# Altium schematic sheet 30V Output Design.schdoc
size 344 x 165 mm; SheetNumber: 1; SheetTotal: 1
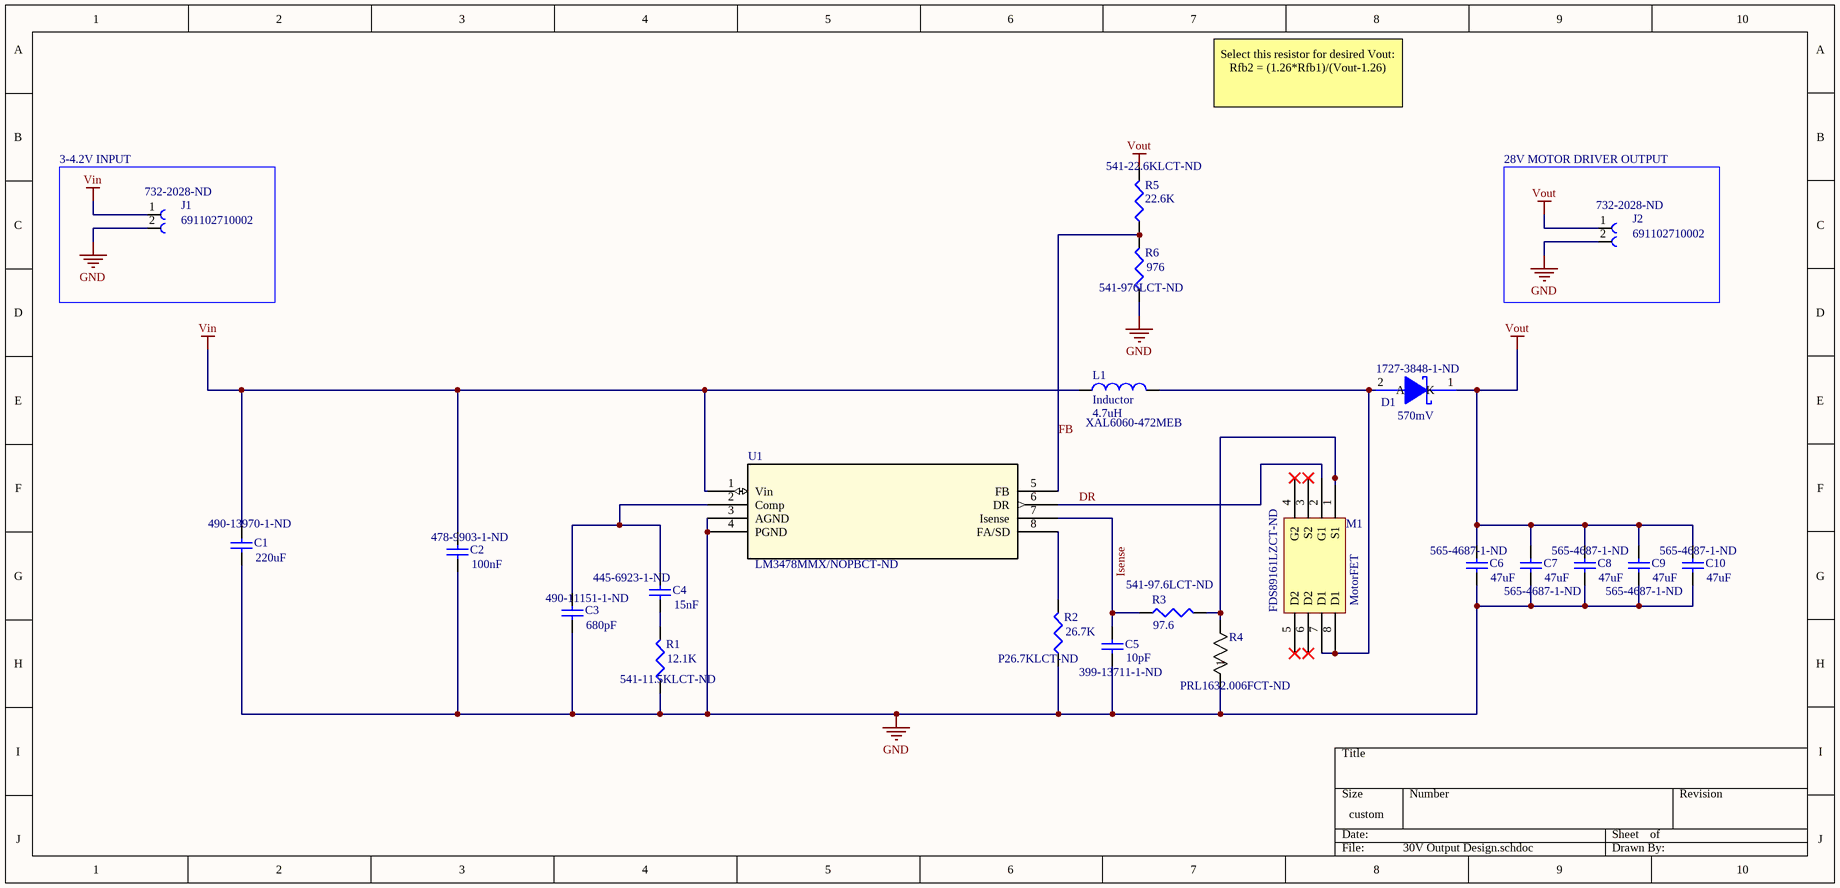
[diagram p0: 30V Output Design.schdoc]

## Parts
C1  value 220uF  Supplier Part Number 1: 490-13970-1-ND  [C1206]  (hidden comment: Input cap)
C2  value 100nF  Supplier Part Number 1: 478-9903-1-ND  [1608[0603]]  (hidden comment: bypass cap)
C3  value 680pF  Supplier Part Number 1: 490-11151-1-ND  [0402]  (hidden comment: CL05C681JB5NNNC)
C4  value 15nF  Supplier Part Number 1: 445-6923-1-ND  [1608[0603]]  (hidden comment: Cap Semi)
C5  value 10pF  Supplier Part Number 1: 399-13711-1-ND  [1608[0603]]  (hidden comment: CL21C100JBANNNC)
C6  value 47uF  Supplier Part Number 1: 565-4687-1-ND  [CAP-2 J-lead]  (hidden comment: Cap Semi)
C7  value 47uF  Supplier Part Number 1: 565-4687-1-ND  [CAP-2 J-lead]
C8  value 47uF  Supplier Part Number 1: 565-4687-1-ND  [CAP-2 J-lead]
C9  value 47uF  Supplier Part Number 1: 565-4687-1-ND  [CAP-2 J-lead]
C10  value 47uF  Supplier Part Number 1: 565-4687-1-ND  [CAP-2 J-lead]
D1  value 570mV  Supplier Part Number 1: 1727-3848-1-ND  [SOD323F]  (hidden comment: PMEG6010CEH,115)
J1  691102710002  Supplier Part Number 1: 732-2028-ND  [CON2_SCREW_5.00MM_691102710002]
J2  691102710002  Supplier Part Number 1: 732-2028-ND  [CON2_SCREW_5.00MM_691102710002]
L1  Inductor  value 4.7uH  Supplier Part Number 1: XAL6060-472MEB  [XAL6060-472]
M1  MotorFET  Supplier Part Number 1: FDS89161LZCT-ND  [MotorFETSOIC127P590X175-8N]
R1  value 12.1K  Supplier Part Number 1: 541-11.5KLCT-ND  [RES_CRCW_0402]
R2  value 26.7K  Supplier Part Number 1: P26.7KLCT-ND  [RES_CRCW_0402]  (hidden comment: Rfadj)
R3  value 97.6  Supplier Part Number 1: 541-97.6LCT-ND  [RES_CRCW_0402]  (hidden comment: Rfilt)
R4  Supplier Part Number 1: PRL1632.006FCT-ND  [RES_3216]  (hidden comment: PRL1632-R006-F-T1)
R5  value 22.6K  Supplier Part Number 1: 541-22.6KLCT-ND  [RES_CRCW_0402]  (hidden comment: Rfb1)
R6  value 976  Supplier Part Number 1: 541-976LCT-ND  [RES_CRCW_0402]  (hidden comment: Rfb2)
U1  Supplier Part Number 1: LM3478MMX/NOPBCT-ND  [MUA08A]  (hidden comment: Part Number: LM3478MMX/NOPB)

## Blocks framed on the sheet
3-4.2V INPUT: J1
28V MOTOR DRIVER OUTPUT: J2

## Nets
GND: C1.1 C2.1 C3.1 C5.1 C6.1 C7.1 C8.1 C9.1 C10.1 J1.2 J2.2 R1.1 R2.1 R4.1 R6.1 U1.3(AGND) U1.4(PGND)
Vin: C1.2 C2.2 J1.1 L1.1 U1.1(Vin)
Vout: C6.2 C7.2 C8.2 C9.2 C10.2 D1.1(K) J2.1 R5.2
DR: M1.2(G1) U1.6(DR)
FB: R5.1 R6.2 U1.5(FB)
Isense: C5.2 R3.1 U1.7(Isense)
NetC3_2: C3.2 C4.2 U1.2(Comp)
NetC4_1: C4.1 R1.2
NetD1_2: D1.2(A) L1.2 M1.7(D1) M1.8(D1)
NetM1_1: M1.1(S1) R3.2 R4.2
NetR2_2: R2.2 U1.8(FA/SD)

Not connected (* = marked no-connect by the designer): M1 3(S2)* 4(G2)* 5(D2)* 6(D2)*

## Notes on the sheet
- Select this resistor for desired Vout:
  Rfb2 = (1.26*Rfb1)/(Vout-1.26)

## Library data of the parts
C1 = Cap Semi: CAP CER 220UF 6.3V X5R 1210; Manufacturer: Murata; Manufacturer Part Number: GRM31CR60J227ME11L; Tolerance: 20%; Published: 8-Jun-2000; LatestRevisionDate: 29-May-2009; LatestRevisionNote: IPC-7351 Footprint Added.; PackageReference: C1206; Publisher: Altium Limited; PackageDescription: Chip Capacitor; Supplier 1: Digi-Key; Stock 1: 189904; Pricing 1: 1=1.52, 10=1.199, 100=0.8992, 500=0.67938, 1000=0.59945 (USD); Mount: Surface Mount; Case/Package: 1206; Case Code (Metric): 3216; Case Code (Imperial): 1206; Min Operating Temperature: -55°C; Max Operating Temperature: 85°C; Packaging: Cut Tape; Voltage Rating: 6.3V; Dielectric: X5R; Voltage Rating (DC): 6.3V; Capacitance: 220uF; Length: 0.126inch; Width: 0.063inch; Thickness: 0.075inch; REACH SVHC: No SVHC
C2 = Cap Semi: Capacitor (Semiconductor SIM Model) https://www.digikey.ca/product-detail/en/avx-corporation/06035C104K4T4A/478-9903-1-ND/6002664; Published: 8-Jun-2000; LatestRevisionDate: 29-May-2009; LatestRevisionNote: IPC-7351 Footprint Added.; PackageReference: C1206; Publisher: Altium Limited; PackageDescription: Chip Capacitor; Supplier 1: Digi-Key
C3 = Cap Semi: CL05C681JB5NNNC - comparator cap 2; Published: 8-Jun-2000; LatestRevisionDate: 29-May-2009; LatestRevisionNote: IPC-7351 Footprint Added.; PackageReference: C1206; Publisher: Altium Limited; PackageDescription: Chip Capacitor; Supplier 1: Digi-Key
C4 = Cap Semi: CGA4F2C0G1H153J085AA comparator cap; Published: 8-Jun-2000; LatestRevisionDate: 29-May-2009; LatestRevisionNote: IPC-7351 Footprint Added.; PackageReference: C1206; Publisher: Altium Limited; PackageDescription: Chip Capacitor; Supplier 1: Digi-Key
C5 = Cap Semi: Capacitor (Semiconductor SIM Model) filter cap; Published: 8-Jun-2000; LatestRevisionDate: 29-May-2009; LatestRevisionNote: IPC-7351 Footprint Added.; PackageReference: C1206; Publisher: Altium Limited; PackageDescription: Chip Capacitor; Supplier 1: Digi-Key
C6-C10 = Cap Semi: EEHZA1H101P - from TI output cap; Manufacturer: United Chemi-Con; Manufacturer Part Number: KTJ500B476M76BFT00; Voltage Rating: 50V; Tolerance: 20%; Lead/Base Style: J-Lead; Published: 8-Jun-2000; LatestRevisionDate: 29-May-2009; LatestRevisionNote: IPC-7351 Footprint Added.; PackageReference: C1206; Publisher: Altium Limited; PackageDescription: Chip Capacitor; Supplier 1: Digi-Key; Stock 1: 2228; Pricing 1: 1=6.35, 10=5.642, 100=4.5135 (USD); Mount: Surface Mount; Case/Package: SMD/SMT; Min Operating Temperature: -55°C; Max Operating Temperature: 125°C; Packaging: Tape and Reel; Capacitance: 47uF; Length: 0.26inch; Width: 0.307inch; Thickness: 0.335inch
D1 = PMEG6010CEH,115: Manufacturer Name: Nexperia; PackageReference: PMEG6010CEH,115; Manufacturer Part Number: PMEG6010CEH,115; Supplier 1: Digi-Key; Manufacturer: Nexperia; Stock 1: 43160; Pricing 1: 1=0.46, 10=0.344, 100=0.2141, 500=0.1465, 1000=0.11269 (USD)
J1 J2 = 691102710002: Screw terminal 0.33 mmÂ² Number of pins 2 Wuerth Elektronik Blue 1 pc_s_; MF: Wurth Electronics; Availability: Unavailable; MP: 691102710002; SnapEDA_Link: https://www.snapeda.com/parts/691102710002/Wurth%20Electronics%20Inc./view-part/?ref=snap; Price: None; Package: None; Value: *; Supplier 1: Digi-Key
L1 = Inductor: Inductor CoilCraft; Code_IEC: 1005; Core Material: Composite; Shielding: Shielded; Tolerance: 20%; Self Resonant Frequency: 21MHz; Max DC Current: 11A; DC Resistance (DCR): 14.4mR; Test Frequency: 100kHz; Published: 8-Jun-2000; LatestRevisionDate: 29-May-2009; LatestRevisionNote: IPC-7351 Footprint Added.; PackageReference: 0402-A; Publisher: Altium Limited; PackageDescription: Chip Inductor; Code_JEITA: 0402; Supplier 1: Coilcraft Direct; Manufacturer: Coilcraft; Manufacturer Part Number: XAL6060-472MEB; Stock 1: 0; Pricing 1: 1=2.58, 100=2.25, 250=1.76, 500=1.05, 1000=0.82, 2500=0.71 (USD); Min Operating Temperature: -40°C; Max Operating Temperature: 125°C; Packaging: Tape and Reel; Package Quantity: 21; Inductance: 4.7uH; Termination: SMD/SMT; Length: 6.76mm; Height: 6.1mm; Width: 6.56mm; Lead Free: Contains Lead
M1 = MotorFET: Manufacturer: ON Semiconductor / Fairchild; Manufacturer Part Number: FDS89161LZ; Rds On Max: 105mR; Input Capacitance: 302pF; Rise Time: 10ns; Drain to Source Voltage (Vdss): 100V; Continuous Drain Current (ID): 2.7A; Max Power Dissipation: 1.6W; Power Dissipation: 31W; Turn-Off Delay Time: 9.5ns; Turn-On Delay Time: 3.8ns; Element Configuration: Dual; Gate to Source Voltage (Vgs): 20V; FET Type: 2 N-Channel; Supplier 1: Digi-Key; Stock 1: 13231; Pricing 1: 1=1.51, 10=1.335, 100=1.0548, 500=0.81802, 1000=0.64581 (USD); Mount: Surface Mount; Case/Package: SOIC; Number of Pins: 8; Weight: 0.187g; Min Operating Temperature: -55°C; Max Operating Temperature: 150°C; Package Quantity: 2500; Packaging: Tape and Reel; Drain to Source Breakdown Voltage: 100V; Fall Time: 10ns; Drain to Source Resistance: 105mR; Length: 4.9mm; Height: 1.575mm; Width: 3.9mm; Radiation Hardening: No; ComponentLink1URL: http://www.mouser.com/ds/2/149/FDS89161LZ-108942.pdf?src-supplier=Mouser; ComponentLink1Description: http://www.mouser.com/ds/2/149/FDS89161LZ-108942.pdf?src-supplier=Mouser; ComponentLink2URL: http://www.fairchildsemi.com/ds/FD/FDS89161LZ.pdf?src-supplier=Digi-Key; ComponentLink2Description: http://www.fairchildsemi.com/ds/FD/FDS89161LZ.pdf?src-supplier=Digi-Key; ComponentLink3URL: https://www.fairchildsemi.com/datasheets/FD/FDS89161LZ.pdf?src-supplier=Digi-Key; ComponentLink3Description: https://www.fairchildsemi.com/datasheets/FD/FDS89161LZ.pdf?src-supplier=Digi-Key; ComponentLink4URL: https://www.fairchildsemi.com/datasheets/FD/FDS89161LZ.pdf?src-supplier=Avnet; ComponentLink4Description: https://www.fairchildsemi.com/datasheets/FD/FDS89161LZ.pdf?src-supplier=Avnet; ComponentLink5URL: https://www.fairchildsemi.com/datasheets/FD/FDS89161LZ.pdf?src-supplier=Avnet+Europe; ComponentLink5Description: https://www.fairchildsemi.com/datasheets/FD/FDS89161LZ.pdf?src-supplier=Avnet+Europe
R1 = Res3: comparator resistor; Manufacturer: Vishay; Manufacturer Part Number: CRCW040211K5FKED; Voltage Rating: 50V; Resistance: 11.5kR; Power Rating: 63mW; Tolerance: 1%; Temperature Coefficient: 100ppm/°C; Published: 8-Jun-2000; LatestRevisionDate: 29-May-2009; LatestRevisionNote: IPC-7351 Footprint Added.; PackageReference: J1-0603; Publisher: Altium Limited; PackageDescription: Chip Resistor; Supplier 1: Digi-Key; Stock 1: 7488; Pricing 1: 1=0.1, 10=0.042, 100=0.017, 1000=0.00765, 2500=0.00664, 5000=0.00549 (USD); Case/Package: 0402; Number of Pins: 2; Weight: 2.3E-05oz; Case Code (Metric): 1005; Case Code (Imperial): 0402; Contact Plating: Tin; Min Operating Temperature: -55°C; Max Operating Temperature: 155°C; Packaging: Tape and Reel; Package Quantity: 10; Composition: Thick Film; Number of Terminations: 2; Termination: SMD/SMT; Military Standard: Not; Max Power Dissipation: 63mW; Voltage Rating (DC): 50V; Features: Automotive AEC-Q200; Length: 1mm; Height: 0.35mm; Width: 0.02inch; Depth: 0.5mm; Radiation Hardening: No; REACH SVHC: Unknown; Lead Free: Lead Free; ComponentLink1URL: http://www.vishay.com/docs/20035/dcrcwe3.pdf?src-supplier=Digi-Key; ComponentLink1Description: http://www.vishay.com/docs/20035/dcrcwe3.pdf?src-supplier=Digi-Key; ComponentLink2URL: http://www.mouser.com/ds/2/427/dcrcwe3-109170.pdf?src-supplier=Mouser; ComponentLink2Description: http://www.mouser.com/ds/2/427/dcrcwe3-109170.pdf?src-supplier=Mouser; ComponentLink3URL: http://www.farnell.com/datasheets/1697337.pdf?src-supplier=Farnell; ComponentLink3Description: http://www.farnell.com/datasheets/1697337.pdf?src-supplier=Farnell; ComponentLink4URL: http://uk.rs-online.com/webdocs/0d98/0900766b80d98824.pdf?src-supplier=RSComponents; ComponentLink4Description: http://uk.rs-online.com/webdocs/0d98/0900766b80d98824.pdf?src-supplier=RSComponents; ComponentLink5URL: http://www.farnell.com/datasheets/1697337.pdf?src-supplier=Element14; ComponentLink5Description: http://www.farnell.com/datasheets/1697337.pdf?src-supplier=Element14; ComponentLink6URL: https://www.alliedelec.com/m/d/0c934d6939ccefa68dbe0b96d821c8cf.pdf?src-supplier=Allied+Electronics; ComponentLink6Description: https://www.alliedelec.com/m/d/0c934d6939ccefa68dbe0b96d821c8cf.pdf?src-supplier=Allied+Electronics; ComponentLink7URL: http://www.farnell.com/datasheets/1824995.pdf?src-supplier=Element14; ComponentLink7Description: http://www.farnell.com/datasheets/1824995.pdf?src-supplier=Element14; ComponentLink8URL: http://www.vishay.com/docs/20035/dcrcwe3.pdf?src-supplier=Avnet; ComponentLink8Description: http://www.vishay.com/docs/20035/dcrcwe3.pdf?src-supplier=Avnet; ComponentLink9URL: http://www.farnell.com/datasheets/2111203.pdf?src-supplier=Element14; ComponentLink9Description: http://www.farnell.com/datasheets/2111203.pdf?src-supplier=Element14; ComponentLink10URL: http://www.vishay.com/docs/20035/dcrcwe3.pdf?src-supplier=Avnet+Europe; ComponentLink10Description: http://www.vishay.com/docs/20035/dcrcwe3.pdf?src-supplier=Avnet+Europe; ComponentLink11URL: http://www.farnell.com/datasheets/2045674.pdf?src-supplier=Element14; ComponentLink11Description: http://www.farnell.com/datasheets/2045674.pdf?src-supplier=Element14
R2 = Res3: Resistor CRCW040226K7FKED 0402; Manufacturer: Panasonic; Manufacturer Part Number: ERJ-2RKF2672X; Resistance: 26.7kR; Tolerance: 1%; Power Rating: 100mW; Voltage Rating: 50V; Temperature Coefficient: 100ppm/°C; ComponentLink1URL: http://www.vishay.com/docs/20035/dcrcwe3.pdf?src-supplier=Digi-Key; ComponentLink1Description: http://www.vishay.com/docs/20035/dcrcwe3.pdf?src-supplier=Digi-Key; ComponentLink2URL: http://www.mouser.com/ds/2/427/dcrcwe3-109170.pdf?src-supplier=Mouser; ComponentLink2Description: http://www.mouser.com/ds/2/427/dcrcwe3-109170.pdf?src-supplier=Mouser; ComponentLink3URL: http://www.farnell.com/datasheets/2045673.pdf?src-supplier=Element14; ComponentLink3Description: http://www.farnell.com/datasheets/2045673.pdf?src-supplier=Element14; ComponentLink4URL: http://www.vishay.com/docs/20035/dcrcwe3.pdf?src-supplier=Avnet; ComponentLink4Description: http://www.vishay.com/docs/20035/dcrcwe3.pdf?src-supplier=Avnet; ComponentLink5URL: https://www.alliedelec.com/m/d/0c934d6939ccefa68dbe0b96d821c8cf.pdf?src-supplier=Allied+Electronics; ComponentLink5Description: https://www.alliedelec.com/m/d/0c934d6939ccefa68dbe0b96d821c8cf.pdf?src-supplier=Allied+Electronics; ComponentLink6URL: http://www.farnell.com/datasheets/1697337.pdf?src-supplier=Element14; ComponentLink6Description: http://www.farnell.com/datasheets/1697337.pdf?src-supplier=Element14; ComponentLink7URL: http://www.vishay.com/docs/20035/dcrcwe3.pdf?src-supplier=Future+Electronics; ComponentLink7Description: http://www.vishay.com/docs/20035/dcrcwe3.pdf?src-supplier=Future+Electronics; Supplier 1: Digi-Key; Stock 1: 354659; Pricing 1: 1=0.1, 10=0.055, 100=0.0225, 1000=0.01012, 2500=0.00878, 5000=0.00726 (USD); Mount: Surface Mount; Case/Package: 0402; Case Code (Metric): 1005; Case Code (Imperial): 0402; Contact Plating: Tin; Min Operating Temperature: -55°C; Max Operating Temperature: 155°C; Packaging: Tape and Reel; Package Quantity: 1; Composition: Thick Film; Number of Terminations: 2; Termination: SMD/SMT; Military Standard: Not; Max Power Dissipation: 100mW; Voltage Rating (DC): 50V; Features: Automotive AEC-Q200; Length: 1mm; Height: 0.35mm; Width: 0.02inch; Depth: 0.5mm; REACH SVHC: Yes; Lead Free: Lead Free; ComponentLink8URL: http://www.farnell.com/datasheets/1678782.pdf?src-supplier=Element14; ComponentLink8Description: http://www.farnell.com/datasheets/1678782.pdf?src-supplier=Element14; ComponentLink9URL: https://industrial.panasonic.com/cdbs/www-data/pdf/RDA0000/DMA0000COL11.pdf?src-supplier=Avnet; ComponentLink9Description: https://industrial.panasonic.com/cdbs/www-data/pdf/RDA0000/DMA0000COL11.pdf?src-supplier=Avnet; ComponentLink10URL: http://www.farnell.com/datasheets/1678782.pdf?src-supplier=Farnell; ComponentLink10Description: http://www.farnell.com/datasheets/1678782.pdf?src-supplier=Farnell; ComponentLink11URL: https://industrial.panasonic.com/cdbs/www-data/pdf/RDA0000/DMA0000COL11.pdf?src-supplier=Mouser; ComponentLink11Description: https://industrial.panasonic.com/cdbs/www-data/pdf/RDA0000/DMA0000COL11.pdf?src-supplier=Mouser
R3 = Res3: Resistor CRCW040297R6FKED 0402; Manufacturer: Vishay; Resistance: 97.6R; Tolerance: 1%; Temperature Coefficient: 100ppm/°C; Max Power Dissipation: 63mW; Voltage Rating: 50V; Published: 8-Jun-2000; LatestRevisionDate: 29-May-2009; LatestRevisionNote: IPC-7351 Footprint Added.; PackageReference: J1-0603; Publisher: Altium Limited; PackageDescription: Chip Resistor; Supplier 1: Digi-Key; Manufacturer Part Number: CRCW040297R6FKED; Stock 1: 16178; Pricing 1: 1=0.1, 10=0.042, 100=0.017, 1000=0.00765, 2500=0.00664, 5000=0.00549 (USD); Case/Package: 0402; Number of Pins: 2; Weight: 2.3E-05oz; Case Code (Imperial): 0402; Case Code (Metric): 1005; Contact Plating: Tin; Min Operating Temperature: -55°C; Max Operating Temperature: 155°C; Packaging: Tape and Reel; Package Quantity: 10; Composition: Thick Film; Number of Terminations: 2; Features: Automotive AEC-Q200; Power Rating: 63mW; Termination: SMD/SMT; Military Standard: Not; Voltage Rating (DC): 50V; Length: 1mm; Height: 0.016inch; Width: 0.5mm; Depth: 0.5mm; Radiation Hardening: No; Lead Free: Lead Free; REACH SVHC: Unknown; ComponentLink1URL: http://www.mouser.com/ds/2/427/dcrcwe3-109170.pdf?src-supplier=Mouser; ComponentLink1Description: http://www.mouser.com/ds/2/427/dcrcwe3-109170.pdf?src-supplier=Mouser; ComponentLink2URL: http://www.vishay.com/docs/20035/dcrcwe3.pdf?src-supplier=Avnet; ComponentLink2Description: http://www.vishay.com/docs/20035/dcrcwe3.pdf?src-supplier=Avnet; ComponentLink3URL: http://www.vishay.com/docs/20035/dcrcwe3.pdf?src-supplier=Digi-Key; ComponentLink3Description: http://www.vishay.com/docs/20035/dcrcwe3.pdf?src-supplier=Digi-Key; ComponentLink4URL: http://www.farnell.com/datasheets/2111203.pdf?src-supplier=Element14; ComponentLink4Description: http://www.farnell.com/datasheets/2111203.pdf?src-supplier=Element14; ComponentLink5URL: http://www.farnell.com/datasheets/2045674.pdf?src-supplier=Element14; ComponentLink5Description: http://www.farnell.com/datasheets/2045674.pdf?src-supplier=Element14
R4 = PRL1632-R006-F-T: No Description Available; Vendor: Susumu; Built_By: EMA_UL_Team; Resistance: 6mR; Tolerance: 1%; Power Rating: 1W; Temperature Coefficient: 350ppm/°C; Manufacturer_Part_Number: PRL1632-R006-F-T1; Copyright: Copyright (C) 2018 Accelerated Designs. All rights reserved; RefDes: RefDes; Type: DEV; Value: Value; Supplier 1: Digi-Key; Manufacturer: Susumu; Manufacturer Part Number: PRL1632-R006-F-T1; Stock 1: 19038; Pricing 1: 1=0.69, 10=0.573, 25=0.4912, 50=0.442, 100=0.3848, 250=0.34384, 500=0.27834 (USD); Case/Package: 1206; Case Code (Metric): 3216; Case Code (Imperial): 1206; Min Operating Temperature: -55°C; Max Operating Temperature: 125°C; Package Quantity: 1; Packaging: Tape and Reel; Composition: Thin Film; Number of Terminations: 2; Termination: SMD/SMT; Max Power Dissipation: 1W; Length: 0.063inch; Height: 0.024inch; Width: 0.126inch; Lead Free: Lead Free; ComponentLink1URL: http://www.susumu.co.jp/common/pdf/n_catalog_partition07_en.pdf?src-supplier=Digi-Key; ComponentLink1Description: http://www.susumu.co.jp/common/pdf/n_catalog_partition07_en.pdf?src-supplier=Digi-Key; ComponentLink2URL: http://www.susumu-usa.com/pdf/FootPrint_8_9.pdf?src-supplier=Digi-Key; ComponentLink2Description: http://www.susumu-usa.com/pdf/FootPrint_8_9.pdf?src-supplier=Digi-Key
R5 = Res3: Resistor CRCW040222K6FKED 0402; Manufacturer: Vishay; Resistance: 22.6kR; Tolerance: 1%; Temperature Coefficient: 100ppm/°C; Max Power Dissipation: 63mW; Voltage Rating: 50V; Published: 8-Jun-2000; LatestRevisionDate: 29-May-2009; LatestRevisionNote: IPC-7351 Footprint Added.; PackageReference: J1-0603; Publisher: Altium Limited; PackageDescription: Chip Resistor; Supplier 1: Digi-Key; Manufacturer Part Number: CRCW040222K6FKED; Stock 1: 23178; Pricing 1: 1=0.1, 10=0.042, 100=0.017, 1000=0.00765, 2500=0.00664, 5000=0.00549 (USD); Case/Package: 0402; Number of Pins: 2; Weight: 2.3E-05oz; Contact Plating: Tin; Case Code (Metric): 1005; Case Code (Imperial): 0402; Min Operating Temperature: -55°C; Max Operating Temperature: 155°C; Composition: Thick Film; Packaging: Tape and Reel; Number of Terminations: 2; Package Quantity: 10; Features: Automotive AEC-Q200; Power Rating: 63mW; Termination: SMD/SMT; Military Standard: Not; Length: 1mm; Height: 0.35mm; Width: 0.02inch; Depth: 0.5mm; Radiation Hardening: No; REACH SVHC: Unknown; ComponentLink1URL: http://www.vishay.com/docs/20035/dcrcwe3.pdf?src-supplier=Digi-Key; ComponentLink1Description: http://www.vishay.com/docs/20035/dcrcwe3.pdf?src-supplier=Digi-Key; ComponentLink2URL: http://www.farnell.com/datasheets/1697337.pdf?src-supplier=Element14; ComponentLink2Description: http://www.farnell.com/datasheets/1697337.pdf?src-supplier=Element14; ComponentLink3URL: http://www.vishay.com/docs/20035/dcrcwe3.pdf?src-supplier=Avnet; ComponentLink3Description: http://www.vishay.com/docs/20035/dcrcwe3.pdf?src-supplier=Avnet; ComponentLink4URL: http://uk.rs-online.com/webdocs/0d98/0900766b80d98824.pdf?src-supplier=RSComponents; ComponentLink4Description: http://uk.rs-online.com/webdocs/0d98/0900766b80d98824.pdf?src-supplier=RSComponents; ComponentLink5URL: http://www.vishay.com/docs/20035/dcrcwe3.pdf?src-supplier=Future+Electronics; ComponentLink5Description: http://www.vishay.com/docs/20035/dcrcwe3.pdf?src-supplier=Future+Electronics
R6 = Res3: Resistor CRCW0402976RFKED 0402; Manufacturer: Vishay; Tolerance: 1%; Resistance: 976R; Temperature Coefficient: 100ppm/°C; Max Power Dissipation: 63mW; Voltage Rating: 50V; Published: 8-Jun-2000; LatestRevisionDate: 29-May-2009; LatestRevisionNote: IPC-7351 Footprint Added.; PackageReference: J1-0603; Publisher: Altium Limited; PackageDescription: Chip Resistor; Supplier 1: Digi-Key; Manufacturer Part Number: CRCW0402976RFKED; Stock 1: 305; Pricing 1: 1=0.1, 10=0.042, 100=0.017, 1000=0.00765, 2500=0.00664, 5000=0.00549 (USD); Case/Package: 0402; Number of Pins: 2; Weight: 2.3E-05oz; Case Code (Metric): 1005; Case Code (Imperial): 0402; Contact Plating: Tin; Min Operating Temperature: -55°C; Max Operating Temperature: 155°C; Packaging: Tape and Reel; Package Quantity: 10; Composition: Thick Film; Number of Terminations: 2; Features: Automotive AEC-Q200; Power Rating: 63mW; Termination: SMD/SMT; Military Standard: Not; Voltage Rating (DC): 50V; Length: 1mm; Height: 0.35mm; Width: 0.02inch; Depth: 0.5mm; Radiation Hardening: No; Lead Free: Lead Free; REACH SVHC: Unknown; ComponentLink1URL: http://www.vishay.com/docs/20035/dcrcwe3.pdf?src-supplier=Digi-Key; ComponentLink1Description: http://www.vishay.com/docs/20035/dcrcwe3.pdf?src-supplier=Digi-Key; ComponentLink2URL: http://www.vishay.com/docs/20035/dcrcwe3.pdf?src-supplier=Avnet; ComponentLink2Description: http://www.vishay.com/docs/20035/dcrcwe3.pdf?src-supplier=Avnet; ComponentLink3URL: http://www.farnell.com/datasheets/125364.pdf?src-supplier=Element14; ComponentLink3Description: http://www.farnell.com/datasheets/125364.pdf?src-supplier=Element14; ComponentLink4URL: http://www.vishay.com/docs/20035/dcrcwe3.pdf?src-supplier=Future+Electronics; ComponentLink4Description: http://www.vishay.com/docs/20035/dcrcwe3.pdf?src-supplier=Future+Electronics; ComponentLink5URL: https://www.alliedelec.com/m/d/0c934d6939ccefa68dbe0b96d821c8cf.pdf?src-supplier=Allied+Electronics; ComponentLink5Description: https://www.alliedelec.com/m/d/0c934d6939ccefa68dbe0b96d821c8cf.pdf?src-supplier=Allied+Electronics; ComponentLink6URL: http://www.farnell.com/datasheets/1697337.pdf?src-supplier=Element14; ComponentLink6Description: http://www.farnell.com/datasheets/1697337.pdf?src-supplier=Element14; ComponentLink7URL: http://www.farnell.com/datasheets/2045673.pdf?src-supplier=Element14; ComponentLink7Description: http://www.farnell.com/datasheets/2045673.pdf?src-supplier=Element14; ComponentLink8URL: http://www.mouser.com/ds/2/427/dcrcwe3-109170.pdf?src-supplier=Mouser; ComponentLink8Description: http://www.mouser.com/ds/2/427/dcrcwe3-109170.pdf?src-supplier=Mouser
U1 = LM3478MMX/NOPB: No Description Available; Manufacturer: TI National Semiconductor; Vendor: Texas Instruments; Built_By: EMA_UL_Team; Number of Outputs: 1; Operating Supply Voltage: 40V; Output Voltage: 1.26V; Output Current: 1A; Switching Frequency: 1MHz; Max Duty Cycle: 100%; Quiescent Current: 2.7mA; Manufacturer_Part_Number: LM3478MMX/NOPB; Copyright: Copyright (C) 2018 Accelerated Designs. All rights reserved; RefDes: RefDes; Type: DEV; Value: Value; Supplier 1: Digi-Key; Manufacturer Part Number: LM3478MMX/NOPB; Stock 1: 8189; Pricing 1: 1=2.21, 10=1.982, 100=1.5928, 500=1.30862, 1000=1.08428 (USD); Mount: Surface Mount; Case/Package: MSOP; Number of Pins: 8; Contact Plating: Tin,Matte; Min Operating Temperature: -40°C; Max Operating Temperature: 125°C; Packaging: Tape and Reel; Max Frequency: 1MHz; Duty Cycle: 100%; Radiation Hardening: No; Lead Free: Lead Free; ComponentLink1URL: http://www.ti.com/lit/ds/symlink/lm3478.pdf?src-supplier=Digi-Key; ComponentLink1Description: http://www.ti.com/lit/ds/symlink/lm3478.pdf?src-supplier=Digi-Key